# Altium project OEE-Schematics.PrjPcb
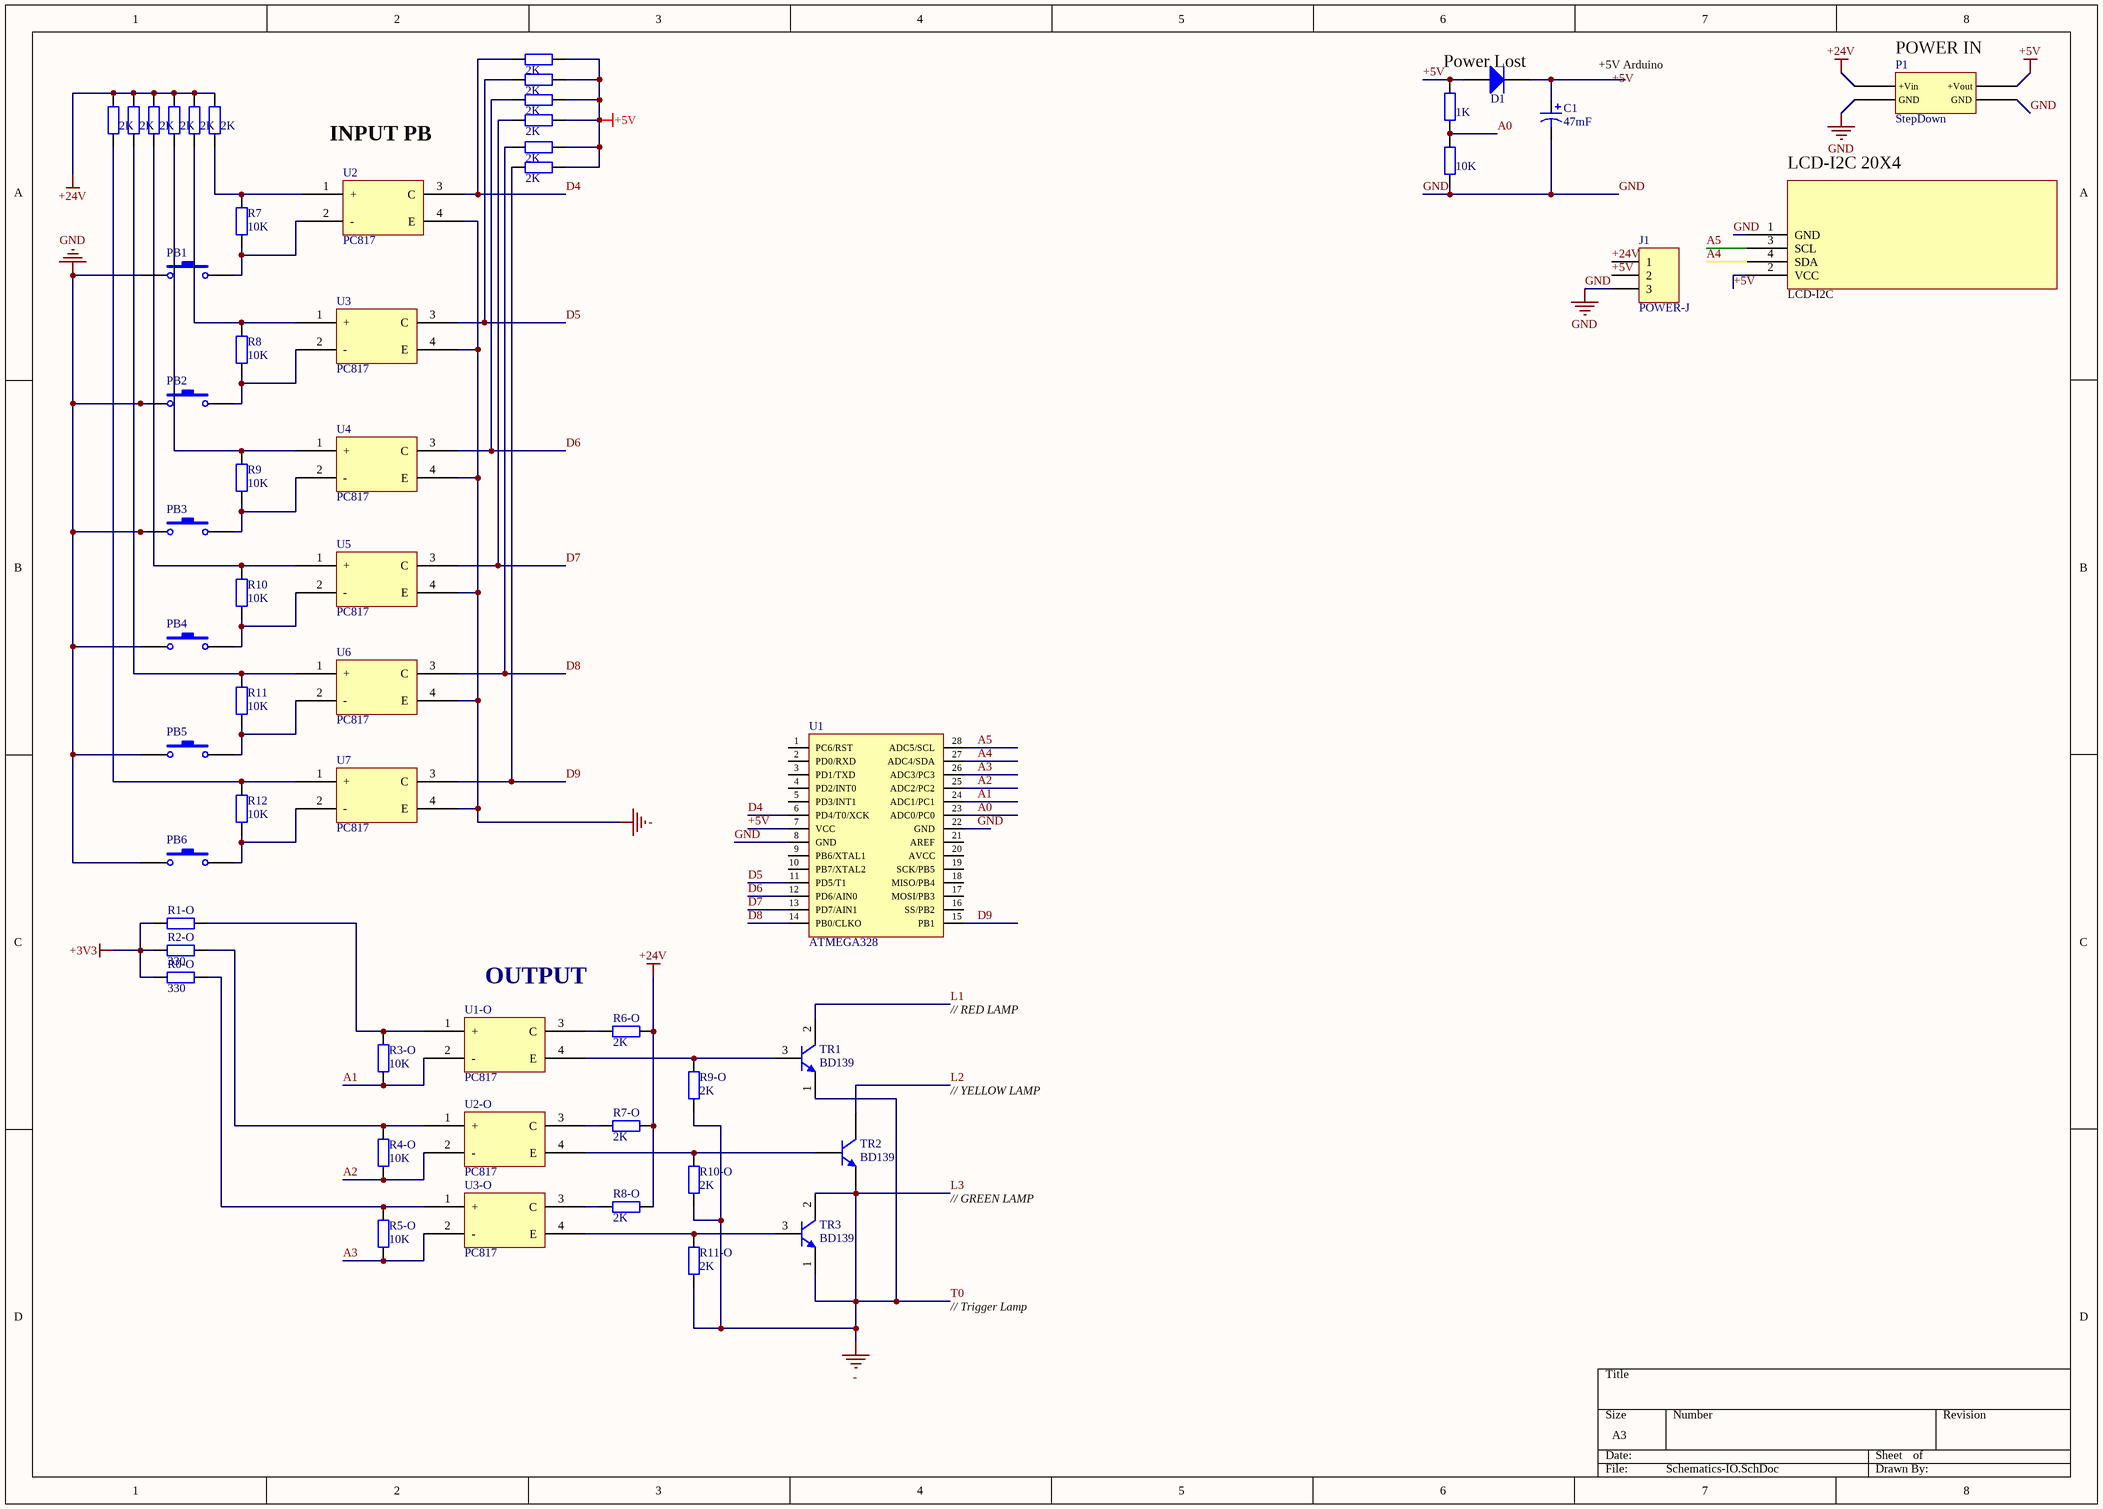
[diagram p0: Schematics-IO.SchDoc]
1 sheet, 56 parts. Net scope: global (net labels, ports and power ports of the same name join across sheets).
Board file: PCB-OEE-Test.PcbDoc

## Sheet Schematics-IO.SchDoc
size A3

### Parts
C1  value 47mF  [RB7.6-15]  (hidden comment: p Pol1)
D1  Diode  [SMC]  (value not drawn)
J1  POWER-J  [HDR1X3]
P1  StepDown  [MODULE4]
PB1  NG+  [SPST-2]  (value not drawn)
PB2  NG+  [SPST-2]  (value not drawn)
PB3  NG+  [SPST-2]  (value not drawn)
PB4  NG+  [SPST-2]  (value not drawn)
PB5  NG+  [SPST-2]  (value not drawn)
PB6  NG+  [SPST-2]  (value not drawn)
R0-O  value 330  [AXIAL-0.4]  (hidden comment: Res2)
R1  value 2K  [AXIAL-0.4]  (hidden comment: Res2)
R1-O  Res2  [AXIAL-0.4]  (value not drawn)
R2  value 2K  [AXIAL-0.4]  (hidden comment: Res2)
R2-O  value 330  [AXIAL-0.4]  (hidden comment: Res2)
R3  value 2K  [AXIAL-0.4]  (hidden comment: Res2)
R3-O  value 10K  [AXIAL-0.4]  (hidden comment: Res2)
R4  value 2K  [AXIAL-0.4]  (hidden comment: Res2)
R4-O  value 10K  [AXIAL-0.4]  (hidden comment: Res2)
R5  value 2K  [AXIAL-0.4]  (hidden comment: Res2)
R5-O  value 10K  [AXIAL-0.4]  (hidden comment: Res2)
R6  value 2K  [AXIAL-0.4]  (hidden comment: Res2)
R6-O  value 2K  [AXIAL-0.4]  (hidden comment: Res2)
R7  value 10K  [AXIAL-0.4]  (hidden comment: Res2)
R7-O  value 2K  [AXIAL-0.4]  (hidden comment: Res2)
R8  value 10K  [AXIAL-0.4]  (hidden comment: Res2)
R8-O  value 2K  [AXIAL-0.4]  (hidden comment: Res2)
R9  value 10K  [AXIAL-0.4]  (hidden comment: Res2)
R9-O  value 2K  [AXIAL-0.4]  (hidden comment: Res2)
R10  value 10K  [AXIAL-0.4]  (hidden comment: Res2)
R10-O  value 2K  [AXIAL-0.4]  (hidden comment: Res2)
R11  value 10K  [AXIAL-0.4]  (hidden comment: Res2)
R11-O  value 2K  [AXIAL-0.4]  (hidden comment: Res2)
R12  value 10K  [AXIAL-0.4]  (hidden comment: Res2)
R13  value 2K  [AXIAL-0.4]  (hidden comment: Res2)
R14  value 2K  [AXIAL-0.4]  (hidden comment: Res2)
R15  value 2K  [AXIAL-0.4]  (hidden comment: Res2)
R16  value 2K  [AXIAL-0.4]  (hidden comment: Res2)
R17  value 2K  [AXIAL-0.4]  (hidden comment: Res2)
R18  value 2K  [AXIAL-0.4]  (hidden comment: Res2)
R19  value 1K  [AXIAL-0.4]  (hidden comment: Res2)
R20  value 10K  [AXIAL-0.4]  (hidden comment: Res2)
TR1  BD139  [BD139]
TR2  BD139  [BD139]
TR3  BD139  [BD139]
U1  ATMEGA328  [at328]
U1-O  PC817  [PC817]
U2  PC817  [PC817]
U2-O  PC817  [PC817]
U3  PC817  [PC817]
U3-O  PC817  [PC817]
U4  PC817  [PC817]
U5  PC817  [PC817]
U6  PC817  [PC817]
U7  PC817  [PC817]
U99  LCD-I2C  [MHDR1X4]

### Nets
+3V3: R0-O.1 R1-O.1 R2-O.1
+5V: D1.1(A) J1.2 P1.3(+Vout) R13.1 R14.1 R15.1 R16.1 R17.1 R18.1 R19.1 U1.7(VCC) U99.2(15)
+24V: J1.1 P1.1(+Vin) R1.1 R2.1 R3.1 R4.1 R5.1 R6.1 R6-O.2 R7-O.2 R8-O.2
GND: C1.2 J1.3 P1.2(GND) P1.4(GND) PB1.1 PB2.1 PB3.1 PB4.1 PB5.1 PB6.1 R20.2 U1.8(GND) U1.22(GND) U99.1(16)
L3: R9-O.1 R10-O.1 R11-O.1 TR1.1(E) TR2.1(E) TR3.1(E) TR3.2(C) U2.4(E) U3.4(E) U4.4(E) U5.4(E) U6.4(E) U7.4(E)  [also labelled -, T0]
A0: R19.2 R20.1 U1.23(ADC0/PC0)
A1: R3-O.2 U1.24(ADC1/PC1) U1-O.2(-)
A2: R4-O.2 U1.25(ADC2/PC2) U2-O.2(-)
A3: R5-O.2 U1.26(ADC3/PC3) U3-O.2(-)
A4: U1.27(ADC4/SDA) U99.4
A5: U1.28(ADC5/SCL) U99.3
D4: R13.2 U1.6(PD4/T0/XCK) U2.3(C)
D5: R14.2 U1.11(PD5/T1) U3.3(C)
D6: R15.2 U1.12(PD6/AIN0) U4.3(C)
D7: R16.2 U1.13(PD7/AIN1) U5.3(C)
D8: R17.2 U1.14(PB0/CLKO) U6.3(C)
D9: R18.2 U1.15(PB1) U7.3(C)
L1: TR1.2(C)
L2: TR2.2(C)
NetC1_1: C1.1 D1.2(K)
NetPB1_2: PB1.2 R7.1 U2.2(-)
NetPB2_2: PB2.2 R8.1 U3.2(-)
NetPB3_2: PB3.2 R9.1 U4.2(-)
NetPB4_2: PB4.2 R10.1 U5.2(-)
NetPB5_2: PB5.2 R11.1 U6.2(-)
NetPB6_2: PB6.2 R12.1 U7.2(-)
NetR0-O_2: R0-O.2 R5-O.1 U3-O.1(+)
NetR1-O_2: R1-O.2 R3-O.1 U1-O.1(+)
NetR1_2: R1.2 R12.2 U7.1(+)
NetR2-O_2: R2-O.2 R4-O.1 U2-O.1(+)
NetR2_2: R2.2 R11.2 U6.1(+)
NetR3_2: R3.2 R10.2 U5.1(+)
NetR4_2: R4.2 R9.2 U4.1(+)
NetR5_2: R5.2 R8.2 U3.1(+)
NetR6-O_1: R6-O.1 U1-O.3(C)
NetR6_2: R6.2 R7.2 U2.1(+)
NetR7-O_1: R7-O.1 U2-O.3(C)
NetR8-O_1: R8-O.1 U3-O.3(C)
NetR9-O_2: R9-O.2 TR1.3(B) U1-O.4(E)
NetR10-O_2: R10-O.2 TR2.3(B) U2-O.4(E)
NetR11-O_2: R11-O.2 TR3.3(B) U3-O.4(E)

Not connected (* = marked no-connect by the designer): U1 1(PC6/RST) 2(PD0/RXD) 3(PD1/TXD) 4(PD2/INT0) 5(PD3/INT1) 9(PB6/XTAL1) 10(PB7/XTAL2) 16(SS/PB2) 17(MOSI/PB3) 18(MISO/PB4) 19(SCK/PB5) 20(AVCC) 21(AREF); U99 5 6 7 8 9 10 11 12 13 14

### Notes on the sheet
- (near D1) Power Lost
- +5V Arduino
- (near P1) POWER IN
- (near U2) INPUT PB
- LCD-I2C 20X4
- (near U1-O) OUTPUT
- // RED LAMP
- // YELLOW LAMP
- // GREEN LAMP
- // Trigger Lamp
- Labels drawn without touching a wire or pin: +5V

### Library data of the parts
C1 = Cap Pol1: Polarized Capacitor (Radial); Published: 8-Jun-2000; LatestRevisionDate: 17-Jul-2002; LatestRevisionNote: Re-released for DXP Platform.; PackageReference: RB7.6-15; Publisher: Altium Limited; PackageDescription: Polarized Capacitor (Radial); 2 Leads
D1 = Diode: Default Diode; Published: 8-Jun-2000; LatestRevisionDate: 17-Jul-2002; LatestRevisionNote: Re-released for DXP Platform.; PackageVersion: Sep-1996; PackageReference: SMC; Publisher: Altium Limited; PackageDescription: DO-214-AB/SMC; 2 C-Bend Leads; Body 7.9 x 5.9 mm, inc. leads (LxW); Code_JEDEC: DO-214-AB
J1 = Header 3: Header, 3-Pin; LatestRevisionDate: 17-Jul-2002; LatestRevisionNote: Re-released for DXP Platform.; Publisher: Altium Limited
PB1-PB6 = SW-PB: Switch; Published: 24-Mar-1999; LatestRevisionDate: 17-Jul-2002; LatestRevisionNote: Re-released for DXP Platform.; PackageReference: SPST-2; Publisher: Altium Limited; PackageDescription: Switch; 2 Leads
R0-O R1 R2 R2-O R3 R3-O R4 R4-O R5 R5-O R6 R6-O R7 R7-O R8 R8-O R9 R9-O R10 R10-O R11 R11-O R12-R20 = Res2: Resistor; Published: 8-Jun-2000; LatestRevisionDate: 17-Jul-2002; LatestRevisionNote: Re-released for DXP Platform.; PackageReference: AXIAL-0.4; Publisher: Altium Limited; PackageDescription: Axial Device, Thru-Hole; 2 Leads; 0.4 in Pin Spacing
R1-O = Res2: Resistor; Value: 330; Published: 8-Jun-2000; LatestRevisionDate: 17-Jul-2002; LatestRevisionNote: Re-released for DXP Platform.; PackageReference: AXIAL-0.4; Publisher: Altium Limited; PackageDescription: Axial Device, Thru-Hole; 2 Leads; 0.4 in Pin Spacing
TR1-TR3 = 2N3904: NPN General Purpose Amplifier; Published: 8-Jun-2000; LatestRevisionDate: 15-Jan-2003; LatestRevisionNote: PCB Footprint 'BCY-W3/D4.7' replaced; DatasheetVersion: 1997; PackageVersion: Sep-1998; PackageReference: TO-92A; Publisher: Altium Limited; PackageDescription: TO, Flat Index; 3 In-Line, Axial Leads; Body Dia. 4.5mm; Leads 0.51 x 0.48 mm (max); ComponentLink1Description: Manufacturer Link; ComponentLink1URL: http://www.fairchildsemi.com/; ComponentLink2Description: Datasheet; ComponentLink2URL: http://www.fairchildsemi.com/ds/2N%2F2N3904.pdf
U99 = I2C